# EasyEDA Pro project 陷波器与抬升电路.eprj

# Schematic Schematic1
Board Name: 50Hz陷波器与抬升电路; Create Date: 2024-09-18
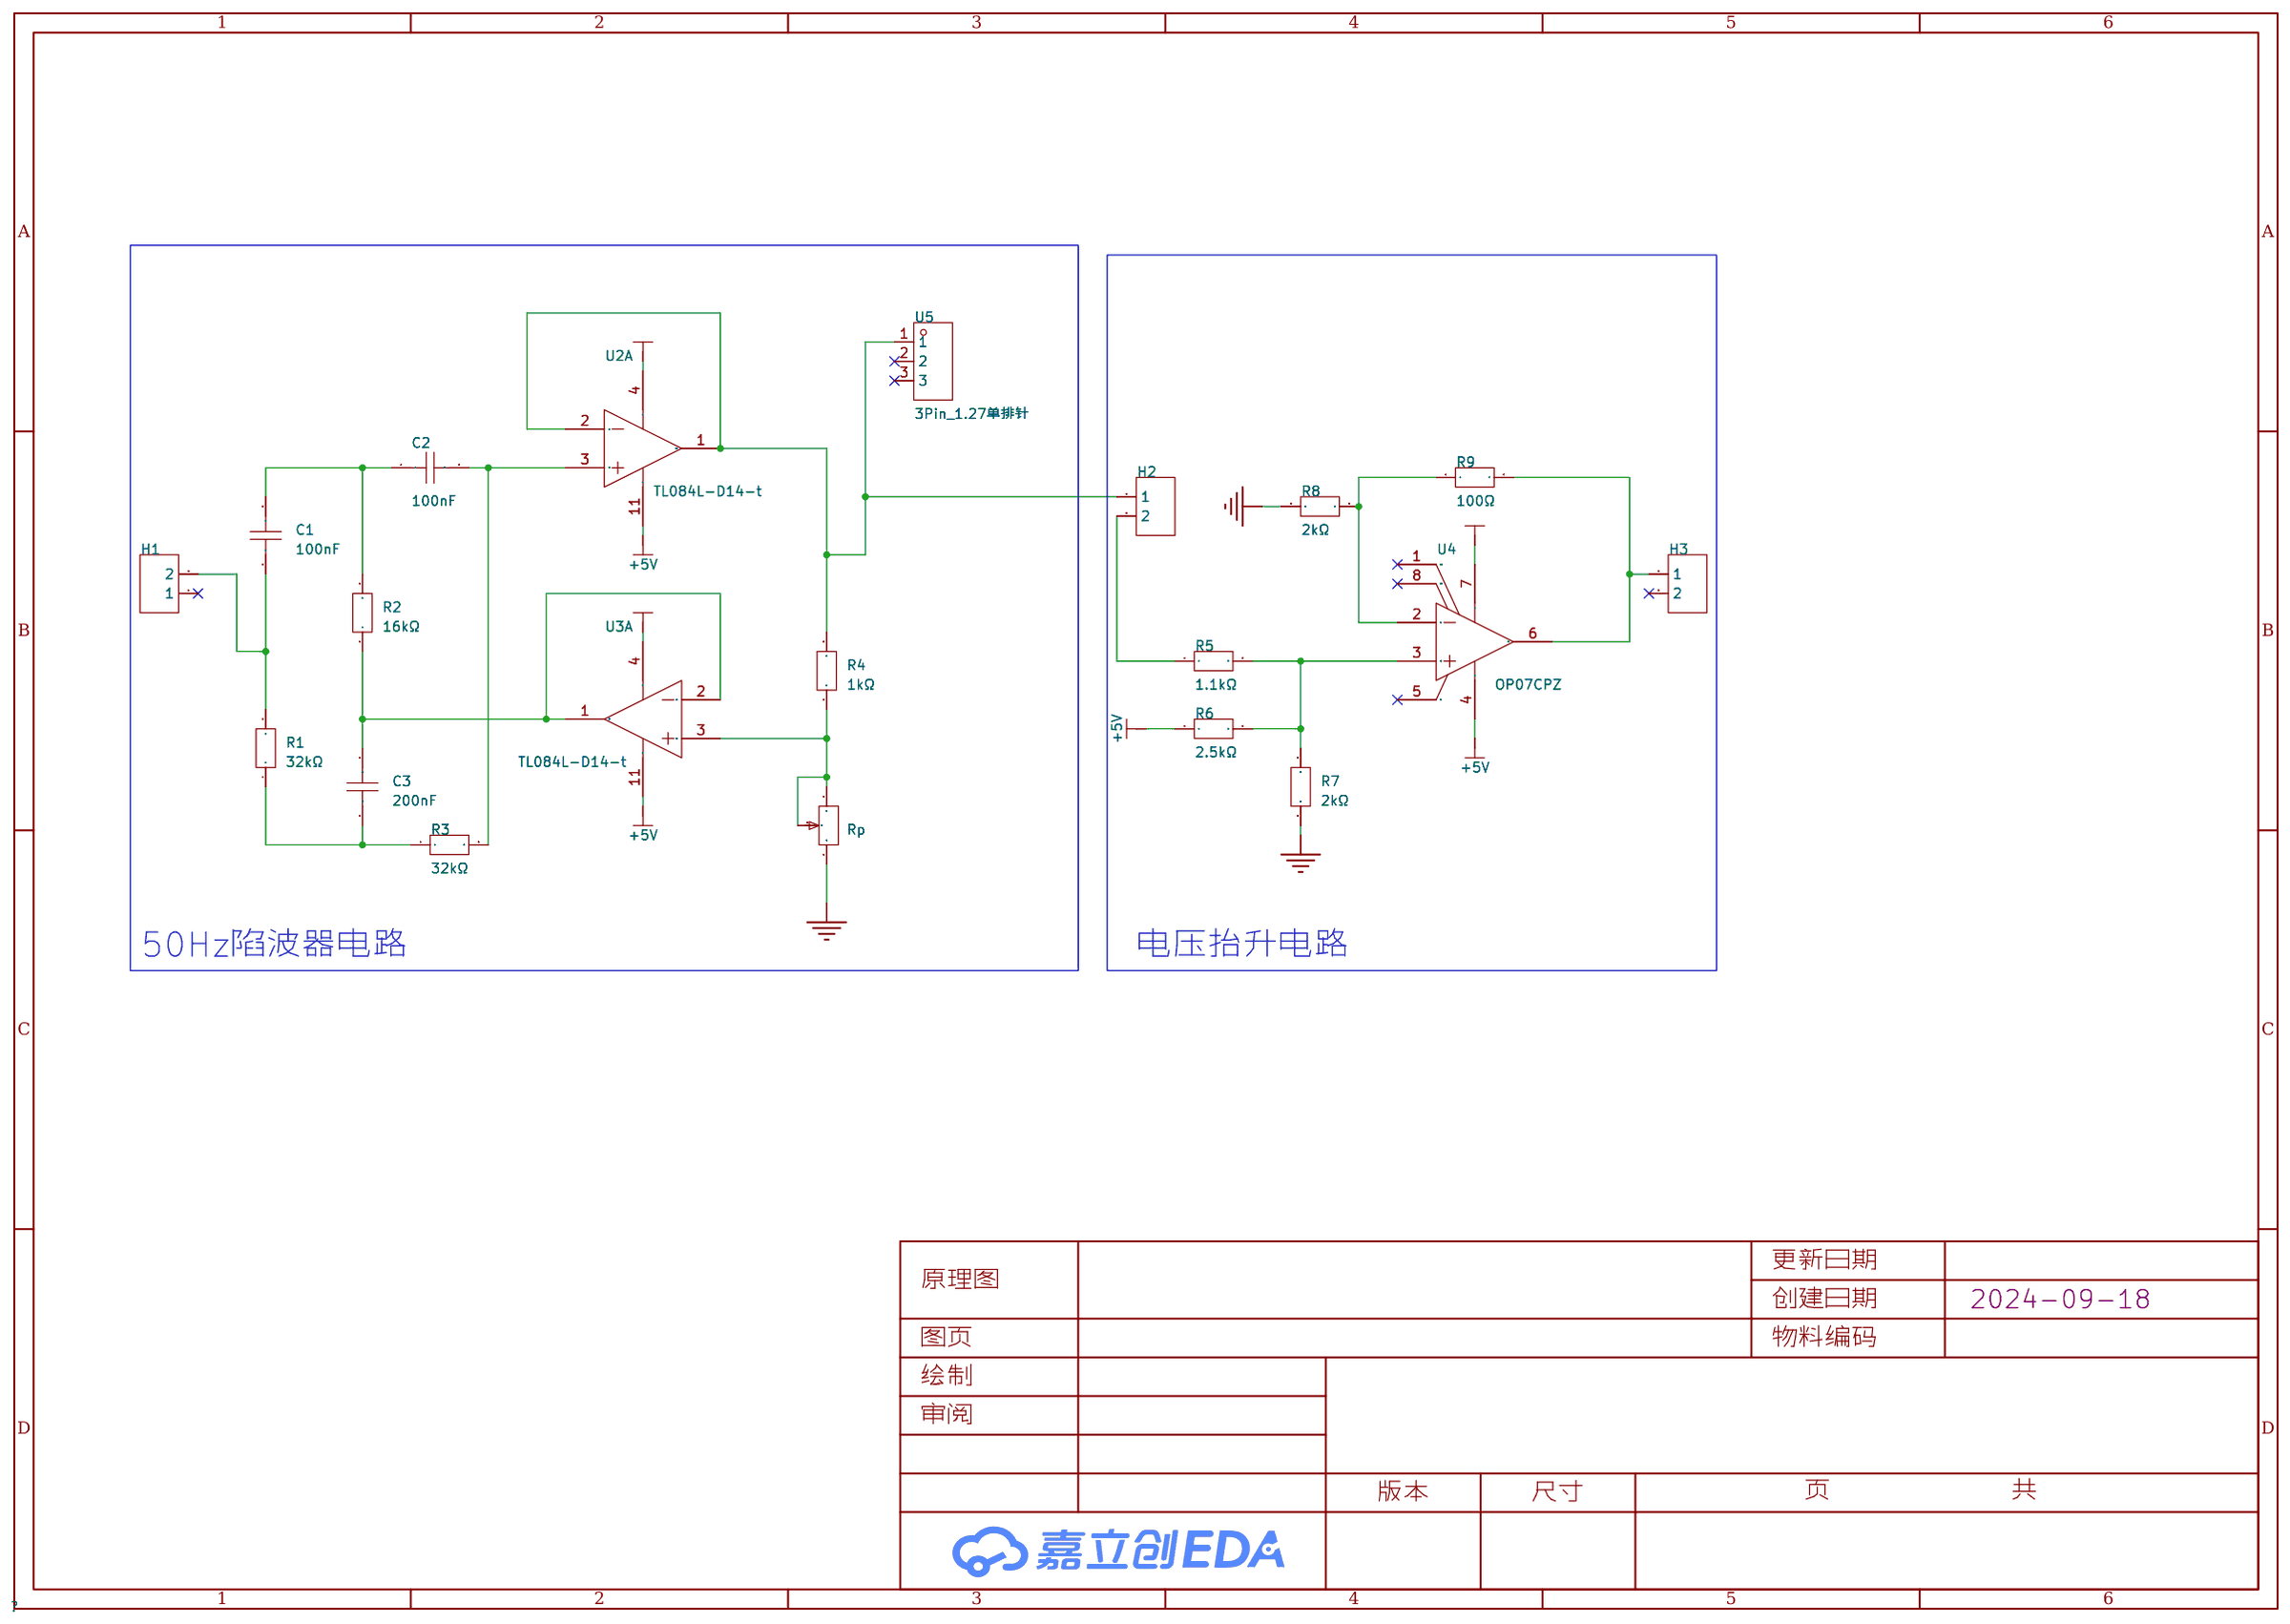
[diagram p0: schematic sheet]

## Parts
C1  100nF  [CAP-TH_L5.1-W3.8-P5.08-D1.2]
C2  100nF  [CAP-TH_L5.1-W3.8-P5.08-D1.2]
C3  200nF  [CAP-TH_L18.0-W8.0-P15.00-D0.8]
H1  -  [HDR-TH_2P-P2.54-V-F]
H2  -  [HDR-TH_2P-P2.54-V-F]
H3  -  [HDR-TH_2P-P2.54-V-F]
R1  32kΩ  [RES-TH_BD2.4-L6.5-P10.50-D0.5]
R2  16kΩ  [RES-TH_BD3.3-L9.0-P13.00-D0.6]
R3  32kΩ  [RES-TH_BD2.4-L6.5-P10.50-D0.5]
R4  1kΩ  [RES-TH_BD2.3-L6.5-P10.50-D0.5]
R5  1.1kΩ  [RES-TH_BD3.3-L9.0-P13.00-D0.6]
R6  2.5kΩ  [RES-TH_BD4.6-L11.4-P15.40-D0.8]
R7  2kΩ  [RES-TH_BD2.3-L6.5-P10.50-D0.5]
R8  2kΩ  [RES-TH_BD2.3-L6.5-P10.50-D0.5]
R9  100Ω  [RES-TH_BD3.7-L10.0-P15.00-D0.6]
Rp  -  [RES-ADJ-TH_3296W]
U2  TL084L-D14-t  [PDIP-14_L19.3-W6.5-P2.54-LS7.6-BL]  (section 1)
U3  TL084L-D14-t  [PDIP-14_L19.3-W6.5-P2.54-LS7.6-BL]  (section 1)
U4  OP07CPZ  [PDIP-8_L9.3-W6.4-P2.54-LS7.6-BL]
U5  3Pin_1.27单排针  [HDR-TH_3P-P1.27-V-M-A]

## Library data of the parts
C1 C2 = C322C104KBR5TA: LCSC Part Name: 100nF ±10% 630V; Supplier Part: C129685; Manufacturer: KEMET(基美); Supplier Footprint: 插件,P=5.08mm; JLCPCB Part Class: 扩展库; Datasheet: https://atta.szlcsc.com/upload/public/pdf/source/20180502/C129685_22A0E9A1A89AC8F69AAACD1F3AA6AB03.pdf; Supplier: LCSC; Tolerance: ±10%; Voltage Rated: 630V; Temperature Coefficient: X7R
C3 = B32922H3204M: LCSC Part Name: 等级:X2 200nF ±20% 305V; Supplier Part: C3298878; Manufacturer: TDK; Supplier Footprint: 插件,P=15mm; JLCPCB Part Class: 扩展库; Datasheet: https://atta.szlcsc.com/upload/public/pdf/source/20240403/6B857094AE2B4215483F52CB5BD16209.pdf; Supplier: LCSC; Tolerance: ±20%; Voltage(AC): 305V; Subclass: X2; Operating Temperature: -40℃~+110℃
H1-H3 = HDR-F_2.54_1x2P: Supplier Part: C49661; Supplier Footprint: 插件
R1 R3 = RNF14BTE32K0: LCSC Part Name: 金属膜电阻 32kΩ ±0.1% 250mW; Supplier Part: C2592661; Manufacturer: SEI(Stackpole Electronics Inc.); Supplier Footprint: 插件,D2.4xL6.4mm; JLCPCB Part Class: 扩展库; Datasheet: https://atta.szlcsc.com/upload/public/pdf/source/20210416/CE3C3DFE1F0E2A8D22EC743938724C43.pdf; Supplier: LCSC; Type: 金属膜电阻; Tolerance: ±0.1%; Power(Watts): 250mW; Temperature Coefficient: ±25ppm/℃; Operating Temperature Range: -55℃~+155℃
R2 = RSF-50JT-52-16K: LCSC Part Name: 金属膜电阻 16kΩ ±5% 500mW; Supplier Part: C1377696; Manufacturer: YAGEO(国巨); Supplier Footprint: 插件,D3.3xL9mm; JLCPCB Part Class: 扩展库; Datasheet: https://atta.szlcsc.com/upload/public/pdf/source/20200722/C705062_59B157870D59CA0881ABA296A8644ADF.pdf; Supplier: LCSC; Type: 金属膜电阻; Tolerance: ±5%; Power(Watts): 500mW; Temperature Coefficient: ±300ppm/℃; Operating Temperature Range: -55℃~+155℃
R4 = MF1/4W-5.1KΩ±1%T52: LCSC Part Name: 金属膜电阻 5.1kΩ ±1% 250mW; Supplier Part: C714010; Manufacturer: 华星机电; Supplier Footprint: 插件,D2.3xL6.5mm; Datasheet: https://atta.szlcsc.com/upload/public/pdf/source/20200731/C713882_AE8EB1102749D7E4FB4FB13DC898C429.pdf; Supplier: LCSC; Type: 金属膜电阻; Tolerance: ±1%; Power(Watts): 250mW; Temperature Coefficient: ±200ppm/℃
R5 = RSF-50JR-52-1K1: LCSC Part Name: 金属膜电阻 1.1kΩ ±5% 500mW; Supplier Part: C1752465; Manufacturer: YAGEO(国巨); Supplier Footprint: 插件,D3.3xL9mm; JLCPCB Part Class: 扩展库; Datasheet: https://atta.szlcsc.com/upload/public/pdf/source/20200722/C705062_59B157870D59CA0881ABA296A8644ADF.pdf; Supplier: LCSC; Type: 金属膜电阻; Tolerance: ±5%; Power(Watts): 500mW; Temperature Coefficient: ±300ppm/℃; Operating Temperature Range: -55℃~+155℃
R6 = WHC2K5FET: LCSC Part Name: 绕线电阻 2.5kΩ ±1% 2W; Supplier Part: C3505401; Manufacturer: Ohmite; Supplier Footprint: 插件,D4.6xL11.4mm; JLCPCB Part Class: 扩展库; Datasheet: https://atta.szlcsc.com/upload/public/pdf/source/20210417/087EAD1F647A2CF587132FB7AFBF5B0A.pdf; Supplier: LCSC; Type: 绕线电阻; Tolerance: ±1%; Power(Watts): 2W; Temperature Coefficient: ±20ppm/℃; Operating Temperature Range: -55℃~+150℃
R7 R8 = MF1/4W-2KΩ±1%T52: LCSC Part Name: 金属膜电阻 2kΩ ±1% 250mW; Supplier Part: C714001; Manufacturer: 华星机电; Supplier Footprint: 插件,D2.3xL6.5mm; JLCPCB Part Class: 扩展库; Datasheet: https://atta.szlcsc.com/upload/public/pdf/source/20200731/C713882_AE8EB1102749D7E4FB4FB13DC898C429.pdf; Supplier: LCSC; Type: 金属膜电阻; Tolerance: ±1%; Power(Watts): 250mW; Temperature Coefficient: ±200ppm/℃
R9 = MMFR3710B100RV9: LCSC Part Name: 金属膜电阻 100Ω ±0.1% 500mW; Supplier Part: C7603277; Manufacturer: RESI(开步睿思); Supplier Footprint: 插件,D3.7xL10mm; Datasheet: https://atta.szlcsc.com/upload/public/pdf/source/20230906/5CDEB36B20538353A7DCF0119D7D7003.pdf; Supplier: LCSC; Type: 金属膜电阻; Tolerance: ±0.1%; Overload Voltage (Max): 300V; Power(Watts): 500mW; Temperature Coefficient: ±5ppm/℃; Operating Temperature Range: -55℃~+125℃
Rp = 精密电位器 3296W/50欧姆: LCSC Part Name: 50Ω; Supplier Part: C21881; Supplier Footprint: VR-3296W; JLCPCB Part Class: 扩展库; Supplier: LCSC
U2 U3 = TL084L-D14-t: Supplier Part: C7509603; Manufacturer: UTC(友顺); Supplier Footprint: DIP-14; JLCPCB Part Class: 扩展库; Datasheet: https://atta.szlcsc.com/upload/public/pdf/source/20230825/21103CE5C41335A2FDBC1DDE797A8A69.pdf; Supplier: LCSC
U4 = OP07CPZ: 超低失调电压运算放大器; Supplier Part: C408829; Manufacturer: ADI(亚德诺); Supplier Footprint: PDIP-8; JLCPCB Part Class: 扩展库; Datasheet: https://atta.szlcsc.com/upload/public/pdf/source/20190807/C408829_BE0F3A08CC30F779D7ED20D5AC7364F9.pdf; Supplier: LCSC
U5 = 3Pin_1.27单排针: Supplier Part: C9900016311; Supplier Footprint: 插件; JLCPCB Part Class: 扩展库; Supplier: LCSC

## Nets
+5V: R6.1 U2.11(V-) U3.11(V-) U4.4(V-)
-5V: U2.4(V+) U3.4(V+) U4.7(V+)
GND: R7.1 R8.1 Rp.3
$1N494: R4.1 Rp.1 Rp.2 U3.3(IN1+)
$1N644: C3.2 R2.1 U3.1(OUT1) U3.2(IN1-)
$1N651: H2.1 R4.2 U2.1(OUT1) U2.2(IN1-) U5.1
$1N781: C2.2 R3.2 U2.3(IN1+)
$1N832: C1.1 H1.2 R1.2
$1N837: C3.1 R1.1 R3.1
$1N911: C1.2 C2.1 R2.2
$1N1076: R5.2 R6.2 R7.2 U4.3(IN+)
$1N1247: H2.2 R5.1
$1N3663: R8.2 R9.1 U4.2(IN-)
$1N3667: H3.1 R9.2 U4.6(OUT)

Not connected (* = marked no-connect by the designer): H1 1*; H3 2*; U4 1(VOS_TRIM)* 5(NC)* 8(VOS_TRIM)*; U5 2* 3*

## Notes on the sheet
- 50Hz陷波器电路
- 电压抬升电路

# Board PCB1
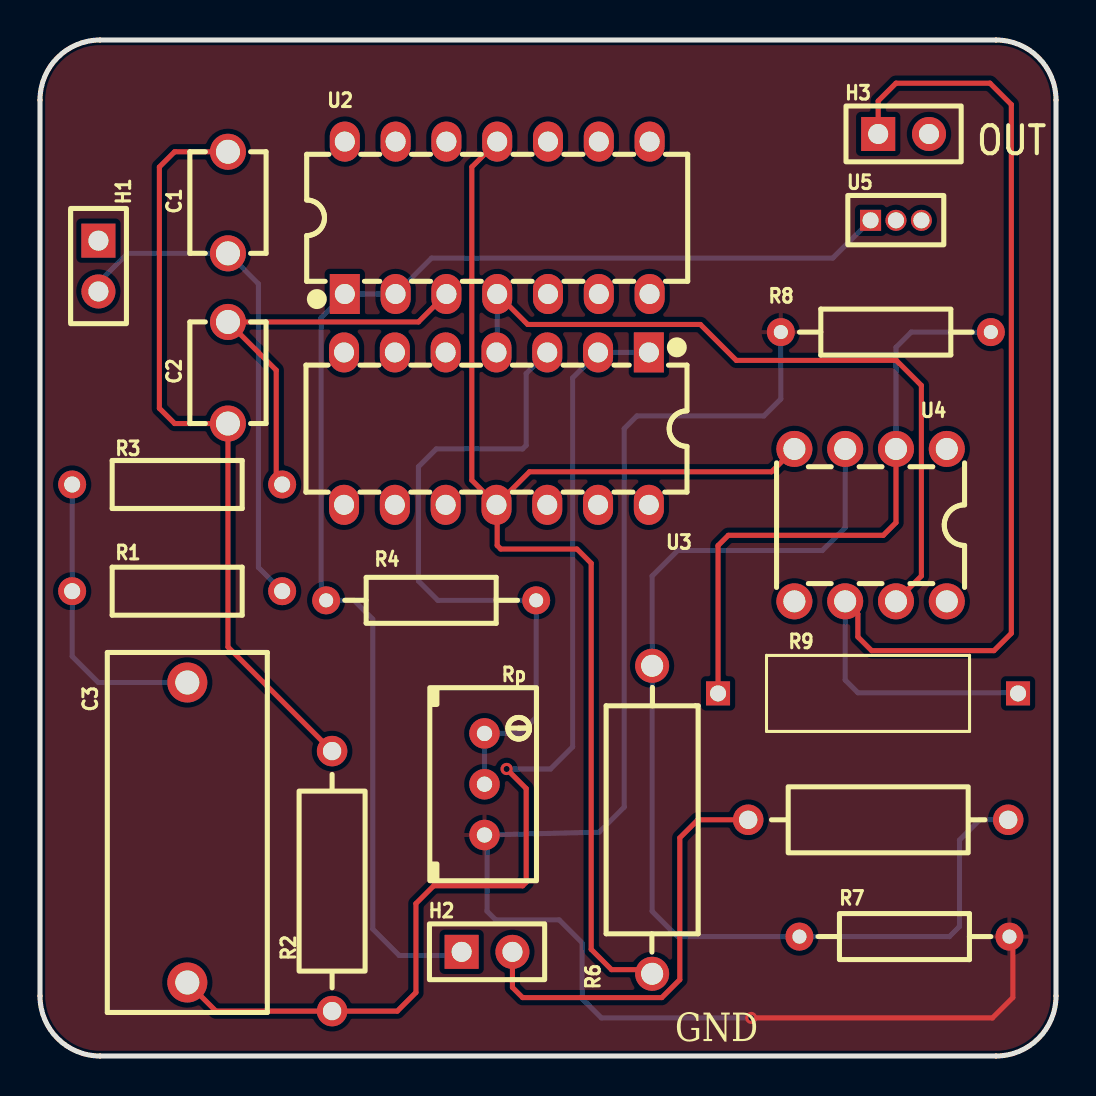
[diagram p1: board, top side]
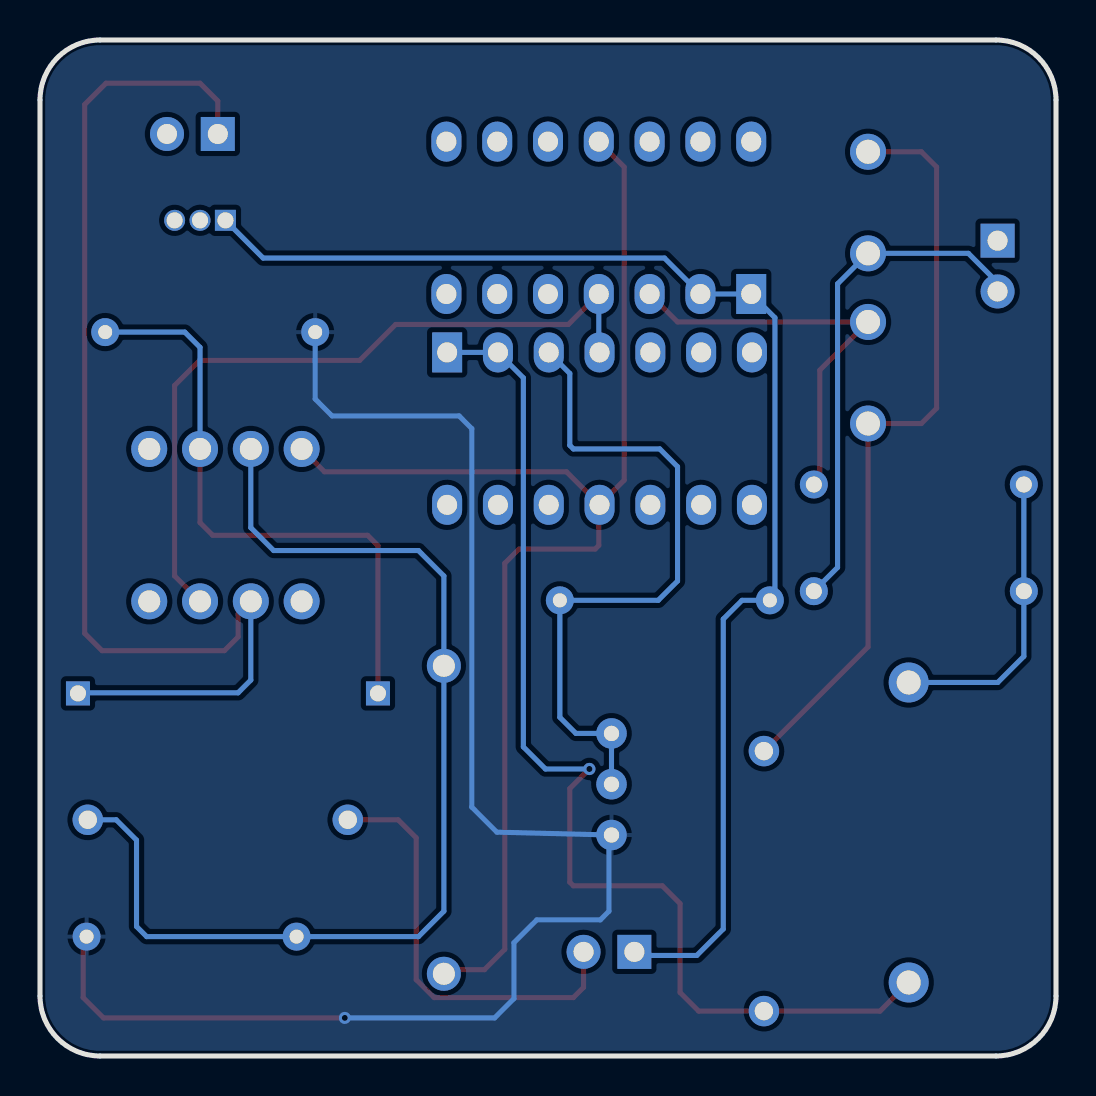
[diagram p2: board, bottom side, seen from below]

Outline 50.8 x 50.8 mm; copper layers: Top Layer, Bottom Layer. Coordinates in mm from the lower left corner of the outline.
Outline path: 0,47.8 0,3 arc(0.88,0.88) 3,0 47.8,0 arc(49.92,0.88) 50.8,3 50.8,47.8 arc(49.92,49.92) 47.8,50.8 3,50.8 arc(0.88,49.92) 0,47.8
Stack: Top Layer 0.035mm / Dielectric1 1.51mm FR4 er 4.5 / Bottom Layer 0.035mm

## Design rules (mm)
template: JLCPCB Capability(Two Layers Board)
spacing copperThickness1oz (default): track to track 0.102, other pairs 0.152 to 0.3
spacing copperThickness2oz: track to track 0.203, other pairs 0.152 to 0.3
track width copperThickness1oz (default): min 0.127, default 0.254, max 2.54
track width copperThickness2oz: min 0.203, default 0.254, max 2.54
differential pair differentialPair (default): width min 0.127, default 0.254, max 2.54; gap min 0.152, default 0.152
via viaSize (default): diameter min 0.5, default 0.61, max 10; hole min 0.3, default 0.305, max 6.3

## Placement (name value [footprint] x y rotation side)
C1  100nF  [CAP-TH_L5.1-W3.8-P5.08-D1.2]  9.4 42.67 90 top
C2  100nF  [CAP-TH_L5.1-W3.8-P5.08-D1.2]  9.4 34.16 90 top
C3  200nF  [CAP-TH_L18.0-W8.0-P15.00-D0.8]  7.37 11.18 270 top
H1  -  [HDR-TH_2P-P2.54-V-F]  2.92 39.5 270 top
H2  -  [HDR-TH_2P-P2.54-V-F]  22.35 5.21 0 top
H3  -  [HDR-TH_2P-P2.54-V-F]  43.18 46.1 0 top
R1  32kΩ  [RES-TH_BD2.4-L6.5-P10.50-D0.5]  6.86 23.24 0 top
R2  16kΩ  [RES-TH_BD3.3-L9.0-P13.00-D0.6]  14.6 8.75 90 top
R3  32kΩ  [RES-TH_BD2.4-L6.5-P10.50-D0.5]  6.86 28.58 0 top
R4  1kΩ  [RES-TH_BD2.3-L6.5-P10.50-D0.5]  19.56 22.78 180 top
R5  1.1kΩ  [RES-TH_BD3.3-L9.0-P13.00-D0.6]  41.91 11.81 0 top
R6  2.5kΩ  [RES-TH_BD4.6-L11.4-P15.40-D0.8]  30.61 11.81 90 top
R7  2kΩ  [RES-TH_BD2.3-L6.5-P10.50-D0.5]  43.22 5.97 180 top
R8  2kΩ  [RES-TH_BD2.3-L6.5-P10.50-D0.5]  42.29 36.2 0 top
R9  100Ω  [RES-TH_BD3.7-L10.0-P15.00-D0.6]  41.4 18.13 0 top
Rp  -  [RES-ADJ-TH_3296W]  22.22 13.59 0 top
U2  TL084L-D14-t  [PDIP-14_L19.3-W6.5-P2.54-LS7.6-BL]  22.86 41.91 0 top
U3  TL084L-D14-t  [PDIP-14_L19.3-W6.5-P2.54-LS7.6-BL]  22.82 31.37 180 top
U4  OP07CPZ  [PDIP-8_L9.3-W6.4-P2.54-LS7.6-BL]  41.53 26.54 180 top
U5  3Pin_1.27单排针  [HDR-TH_3P-P1.27-V-M-A]  42.8 41.78 0 top

## Footprints (pads in the part's own frame, mm; a bottom-side part is the same pattern mirrored in y, then rotated)
CAP-TH_L5.1-W3.8-P5.08-D1.2
  round 1.8 hole 1.2: 1(-2.54,0) 2(2.54,0)
CAP-TH_L18.0-W8.0-P15.00-D0.8
  round 2 hole 1.2: 1(-7.5,0) 2(7.5,0)
HDR-TH_2P-P2.54-V-F
  rect 1.7x1.7 hole 1: 1(-1.27,0)
  round 1.7 hole 1: 2(1.27,0)
HDR-TH_3P-P1.27-V-M-A
  rect 1.05x1.05 hole 0.8: 1(-1.27,0)
  round 1.05 hole 0.8: 2(0,0) 3(1.27,0)
PDIP-8_L9.3-W6.4-P2.54-LS7.6-BL
  round 1.8 hole 1.1: 1(-3.81,-3.81) 2(-1.27,-3.81) 3(1.27,-3.81) 4(3.81,-3.81) 5(3.81,3.81) 6(1.27,3.81) 7(-1.27,3.81) 8(-3.81,3.81)
PDIP-14_L19.3-W6.5-P2.54-LS7.6-BL
  rect 1.5x2 hole 1: 1(-7.62,-3.81)
  oval 1.5x2 hole 1: 2(-5.08,-3.81) 3(-2.54,-3.81) 4(0,-3.81) 5(2.54,-3.81) 6(5.08,-3.81) 7(7.62,-3.81) 8(7.62,3.81) 9(5.08,3.81) 10(2.54,3.81) 11(0,3.81) 12(-2.54,3.81) 13(-5.08,3.81) 14(-7.62,3.81)
RES-ADJ-TH_3296W
  round 1.524 hole 0.762: 1(0,2.54) 2(0,0) 3(0,-2.54)
RES-TH_BD2.3-L6.5-P10.50-D0.5
  round 1.4 hole 0.7: 1(-5.25,0) 2(5.25,0)
RES-TH_BD2.4-L6.5-P10.50-D0.5
  round 1.4 hole 0.8: 1(-5.25,0) 2(5.25,0)
RES-TH_BD3.3-L9.0-P13.00-D0.6
  round 1.524 hole 0.914: 1(-6.5,0) 2(6.5,0)
RES-TH_BD3.7-L10.0-P15.00-D0.6
  rect 1.2x1.2 hole 0.8: 1(-7.5,0) 2(7.5,0)
RES-TH_BD4.6-L11.4-P15.40-D0.8
  round 1.7 hole 1.1: 1(-7.7,0) 2(7.7,0)

## Nets
As in the schematic.

Pads without a net: H1 1; H3 2; U2 5 6 7 8 9 10 12 13 14; U3 5 6 7 8 9 10 12 13 14; U4 1 5 8; U5 2 3

## Via types
v1: diameter 0.61, hole 0.305, Top Layer to Bottom Layer, 1 via
v2: diameter 0.6, hole 0.3, Top Layer to Bottom Layer, 1 via

## Routing (per net, layer and track width the routed paths; a pad name or vN(x,y) marks a point on that pad's centre or on a via; arc(x,y) is an arc through that point)
+5V: length 65.3
  Top Layer w0.254: U2.11 21.59,44.45 21.59,28.79 U3.11 ; U3.11 22.86,27.52 22.86,25.53 23.04,25.35 26.85,25.35 27.56,24.64 27.56,5.33 28.57,4.32 30.43,4.32 30.61,4.14 30.61,4.06 ; U3.11 24.47,29.21 36.58,29.21 U4.4
-5V: length 37.4
  Top Layer w0.254: U2.4 24.38,36.58 33.02,36.58 34.82,34.78 42.82,34.78 44.07,33.53 44.07,24 U4.7
  Bottom Layer w0.254: U2.4 22.86,35.22 U3.4
GND: length 75.8
  Top Layer w0.254: R7.1 48.64,5.8 48.64,2.92 47.62,1.91 v2(35.56,1.91)
  Bottom Layer w0.254: v2(35.56,1.91) 28.07,1.91 27.1,2.87 27.1,5.66 25.96,6.81 22.79,6.81 22.35,7.24 22.35,10.92 Rp.3 27.96,11.19 29.21,12.45 29.21,31.37 29.84,32 36.19,32 37.04,32.85 R8.1
$1N494: length 34.2
  Bottom Layer w0.254: Rp.2 22.22,16.13 24,16.13 24.81,16.93 R4.1 19.89,22.78 18.92,23.75 18.92,29.46 19.81,30.35 24.13,30.35 24.31,30.53 24.31,34.13 U3.3
$1N644: length 55.4
  Top Layer w0.254: C3.2 8.8,2.25 R2.1 17.87,2.25 18.8,3.18 18.8,7.62 19.69,8.51 24.13,8.51 24.31,8.69 24.31,13.37 v1(23.33,14.35)
  Bottom Layer w0.254: U3.1 U3.2 26.63,33.91 26.63,15.46 25.53,14.35 v1(23.33,14.35)
$1N651: length 67
  Bottom Layer w0.254: H2.1 20.9,5.03 17.96,5.03 16.64,6.35 16.64,21.84 15.7,22.78 R4.2 14.05,23.04 14.05,36.91 U2.1 U2.2 19.58,39.9 39.64,39.9 U5.1
$1N781: length 20.8
  Top Layer w0.254: U2.3 18.92,36.7 C2.2 11.81,34.29 11.81,28.83 12.06,28.58 R3.2
$1N832: length 25.5
  Bottom Layer w0.254: H1.2 2.92,38.67 4.38,40.13 C1.1 10.92,38.61 10.92,24.43 R1.2
$1N837: length 14.9
  Bottom Layer w0.254: C3.1 2.91,18.68 1.61,19.98 R1.1 R3.1
$1N911: length 38.1
  Top Layer w0.254: C1.2 6.73,45.21 5.97,44.45 5.97,32.39 6.73,31.62 C2.1 9.4,20.45 R2.2
$1N1076: length 54.6
  Bottom Layer w0.254: R5.2 46.99,11.81 45.97,10.8 45.97,6.48 45.47,5.97 R7.2 ; 37.97,5.97 31.88,5.97 30.61,7.24 R6.2 30.61,24 31.88,25.27 39.12,25.27 40.26,26.42 U4.3
$1N1247: length 21.6
  Top Layer w0.254: R5.1 32.89,11.81 31.99,10.91 31.99,3.82 31.09,2.92 24.13,2.92 23.62,3.43 H2.2
$1N3663: length 30.6
  Top Layer w0.254: R9.1 33.9,25.52 34.42,26.04 42.16,26.04 42.8,26.67 U4.2
  Bottom Layer w0.254: U4.2 42.8,35.43 43.56,36.2 R8.2
$1N3667: length 58.8
  Top Layer w0.254: U4.6 40.89,22.1 40.89,20.96 41.58,20.27 47.7,20.27 48.57,21.13 48.57,47.57 47.5,48.64 42.8,48.64 41.91,47.75 H3.1
  Bottom Layer w0.254: R9.2 48.87,18.16 40.89,18.16 40.26,18.8 U4.6

## Copper pours and planes (outline as drawn; the poured copper is in the pictures)
GND on Top Layer: -0.51,51.44 51.56,51.44 51.56,-0.89 -0.51,-0.89
GND on Bottom Layer: -0.64,50.93 51.56,50.93 51.56,-0.51 -0.64,-0.51

Small or netless copper shapes (teardrops, artwork), in the pictures only: 1 on Bottom Layer

## Text on the board
Top Silkscreen Layer: OUT | GND
